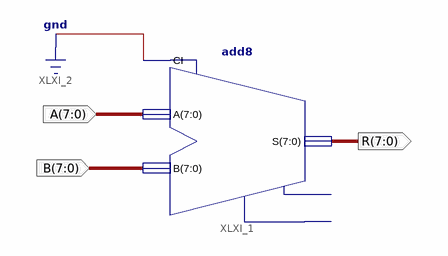
[diagram p0: schematic sheet 1]
// Xilinx ISE schematic add.sch (spartan6) as structural Verilog: 1 symbols, 3 ports
module add (
  input  [7:0] B,
  input  [7:0] A,
  output [7:0] R
);

  add8 XLXI_1 (.A(A), .B(B), .CI(1'b0), .S(R));  // open: CO, OFL
endmodule
